# Altium schematic sheet 海关全向本体电路板V3_电源管理.SchDoc
size A4
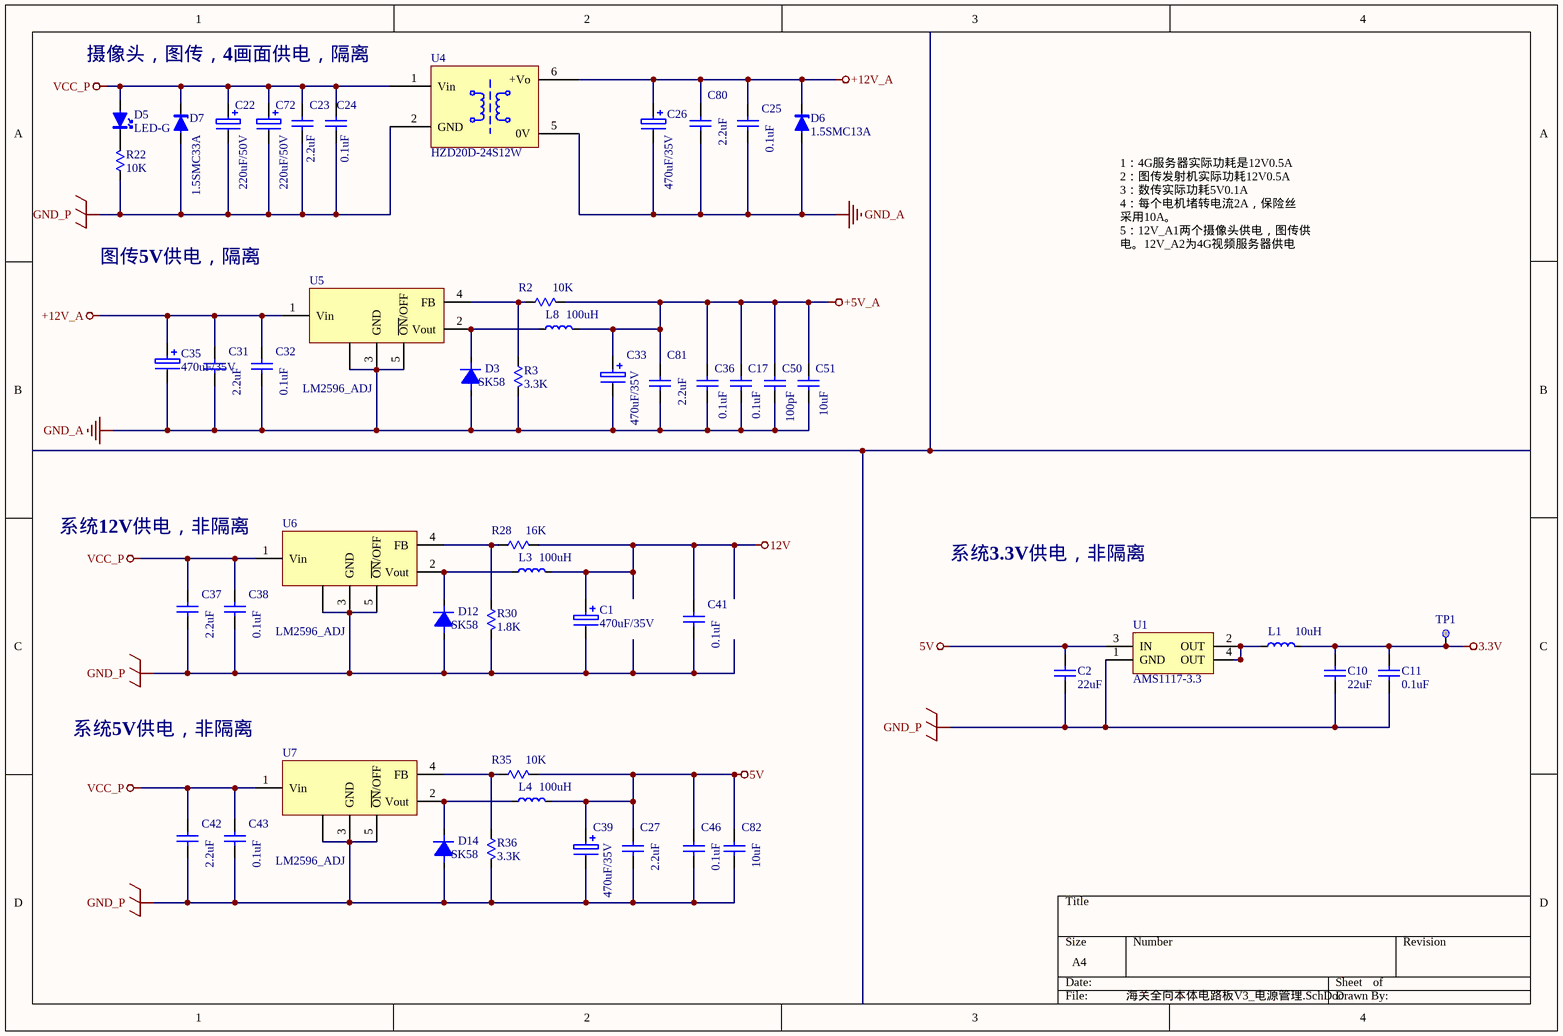
[diagram p0: 海关全向本体电路板V3_电源管理.SchDoc]

## Parts
C1  470uF/35V  [CAPPR-10X10-SM]
C2  22uF  [C1206-S]
C10  22uF  [C1206-S]
C11  0.1uF  [C0603-S]
C17  0.1uF  [C0603-S]
C22  220uF/50V  [CAPPR-10X10-SM]
C23  2.2uF  [C1210-S]
C24  0.1uF  [C0603-S]
C25  0.1uF  [C0603-S]
C26  470uF/35V  [CAPPR-10X10-SM]
C27  2.2uF  [C1210-S]
C31  2.2uF  [C1210-S]
C32  0.1uF  [C0603-S]
C33  470uF/35V  [CAPPR-10X10-SM]
C35  470uF/35V  [CAPPR-10X10-SM]
C36  0.1uF  [C0603-S]
C37  2.2uF  [C1210-S]
C38  0.1uF  [C0603-S]
C39  470uF/35V  [CAPPR-10X10-SM]
C41  0.1uF  [C0603-S]
C42  2.2uF  [C1210-S]
C43  0.1uF  [C0603-S]
C46  0.1uF  [C0603-S]
C50  100pF  [C0603-S]
C51  10uF  [C0603-S]
C72  220uF/50V  [CAPPR-10X10-SM]
C80  2.2uF  [C1210-S]
C81  2.2uF  [C1210-S]
C82  10uF  [C0603-S]
D3  SK58  [SMB-S]
D5  LED-G  [LED0805-S]
D6  1.5SMC13A  [SMC-S]
D7  1.5SMC33A  [SMC-S]
D12  SK58  [SMB-S]
D14  SK58  [SMB-S]
L1  10uH  [L0805-C]
L3  100uH  [L5050-P]
L4  100uH  [L5050-P]
L8  100uH  [L5050-P]
R2  10K  [R0805-S]
R3  3.3K  [R0805-S]
R22  10K  [R0805-S]
R28  16K  [R0805-S]
R30  1.8K  [R0805-S]
R35  10K  [R0805-S]
R36  3.3K  [R0805-S]
TP1  TestPoint  [MARK-S]  (value not drawn)
U1  AMS1117-3.3  [SOT-223]
U4  HZD20D-24S12W  [HZD20D-24S12W]
U5  LM2596_ADJ  [TO263]
U6  LM2596_ADJ  [TO263]
U7  LM2596_ADJ  [TO263]

## Nets
3.3V: C10.1 C11.2 L1.1 TP1.1
5V: C2.1 C27.2 C39.1 C46.2 C82.2 L4.1 R35.1 U1.3(IN)
12V: C1.1 C41.2 L3.1 R28.1
+5V_A: C17.2 C33.1 C36.2 C50.2 C51.2 C81.2 L8.1 R2.1
+12V_A: C25.2 C26.1 C31.2 C32.2 C35.1 C80.2 D6.2(K) U4.6(+Vo) U5.1(Vin)
GND_A: C17.1 C25.1 C26.2 C31.1 C32.1 C33.2 C35.2 C36.1 C50.1 C51.1 C80.1 C81.1 D3.1(A) D6.1(A) R3.1 U4.5(0V) U5.0(GND) U5.3(GND) U5.5(~{ON}/OFF)
GND_P: C1.2 C2.2 C10.2 C11.1 C22.2 C23.1 C24.1 C27.1 C37.1 C38.1 C39.2 C41.1 C42.1 C43.1 C46.1 C72.2 C82.1 D7.1(A) D12.1(A) D14.1(A) R22.2 R30.1 R36.1 U1.1(GND) U4.2(GND) U6.0(GND) U6.3(GND) U6.5(~{ON}/OFF) U7.0(GND) U7.3(GND) U7.5(~{ON}/OFF)
VCC_P: C22.1 C23.2 C24.2 C37.2 C38.2 C42.2 C43.2 C72.1 D5.1(A) D7.2(K) U4.1(Vin) U6.1(Vin) U7.1(Vin)
NetD3_2: D3.2(K) L8.2 U5.2(Vout)
NetD5_2: D5.2(K) R22.1
NetD12_2: D12.2(K) L3.2 U6.2(Vout)
NetD14_2: D14.2(K) L4.2 U7.2(Vout)
NetL1_2: L1.2 U1.2(OUT) U1.4(OUT)
NetR2_2: R2.2 R3.2 U5.4(FB)
NetR28_2: R28.2 R30.2 U6.4(FB)
NetR35_2: R35.2 R36.2 U7.4(FB)

## Notes on the sheet
- 摄像头，图传，4画面供电，隔离
- 图传5V供电，隔离
- 1：4G服务器实际功耗是12V0.5A
  2：图传发射机实际功耗12V0.5A
  3：数传实际功耗5V0.1A
  4：每个电机堵转电流2A，保险丝        采用10A。
  5：12V_A1两个摄像头供电，图传供电。12V_A2为4G视频服务器供电
- 系统12V供电，非隔离
- 系统3.3V供电，非隔离
- 系统5V供电，非隔离

## Library data of the parts
C1 C22 C26 C33 C35 C39 C72 = ELECTRO: Electrolytic Capacitor
C2 C10 C11 C17 C23-C25 C27 C31 C32 C36-C38 C41-C43 C46 C50 C51 C80-C82 = CAP: Published: 8-Jun-2000; LatestRevisionDate: 17-Jul-2002; LatestRevisionNote: Re-released for DXP Platform.; PackageReference: RAD-0.3; Publisher: Altium Limited
  C2 C10: Value: 22uF
  C11 C17 C24 C25 C32 C36 C38 C41 C43 C46: Value: 0.1uF
  C23 C27 C31 C37 C42 C80 C81: Value: 2.2uF
  C50: Value: 100pF
  C51 C82: Value: 10uF
D3 D12 D14 = DIODE1: Diode
D5 = LED
D6 D7 = DIODE-ZENER: Small Signal Zener Diodes
L1 L3 L4 L8 = INDUCTOR: Code_IEC: 1005; Published: 8-Jun-2000; LatestRevisionDate: 17-Jul-2002; LatestRevisionNote: Re-released for DXP Platform.; PackageReference: 0402-A; Publisher: Altium Limited; Code_JEITA: 0402
  L1: Value: 10uH
  L3 L4 L8: Value: 100uH
R2 R3 R28 R30 R35 R36 = RES: Resistor; Published: 8-Jun-2000; LatestRevisionDate: 17-Jul-2002; LatestRevisionNote: Re-released for DXP Platform.; PackageReference: AXIAL-0.3; Publisher: Altium Limited
  R2 R35: Value: 10K
  R3 R36: Value: 3.3K
  R28: Value: 16K
  R30: Value: 1.8K
R22 = Res: Resistor; Published: 8-Jun-2000; LatestRevisionDate: 04-Mar-2005; LatestRevisionNote: PCB Footprint replaced.; PackageReference: J1-0603; Publisher: Altium Limited; Value: 10K
U1 = REG1117-3.3: 800mA and 1A Low Dropout Positive Regulator 2.85V, 3.3V, 5V, and Adjustable; Package Information: Latest Revision: revC; Published: 8-Jun-2000; Revision: 17-Jul-2002: Re-released for DXP Platform.; Datasheet: Latest Revision: Sep-1997; Package Reference: ZZ311; Publisher: Altium Limited
U5-U7 = LM2575